# EAGLE design rotary_encoder_board (EAGLE 7.2.0)
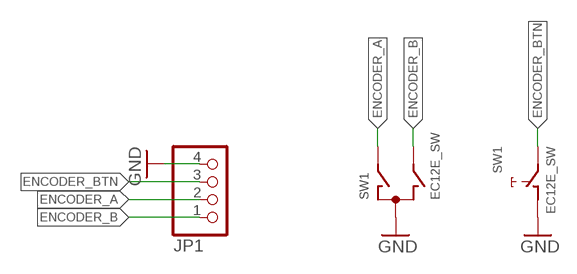
[diagram p0: schematic, sheet 1]

## Parts
JP1  PINHD-1X4/90  [1X04/90]
SW1  EC12E_SW  [ALPS_EC12E_SW]

## Nets
ENCODER_A: JP1.2 SW1.A
ENCODER_B: JP1.1 SW1.B
ENCODER_BTN: JP1.3 SW1.E
GND: JP1.4 SW1.C SW1.D
Unconnected: SW1.GND1(G) SW1.GND2(G)

## Library data of the parts
JP1 = pinhead:PINHD-1X4: PIN HEADER
SW1 = switch-alps:EC12E_SW: ALPS rotary Encoder EC12E series with switch; MPN: EC12E2424407; OC_FARNELL: 1520813; OC_NEWARK: 74M1068

## Board
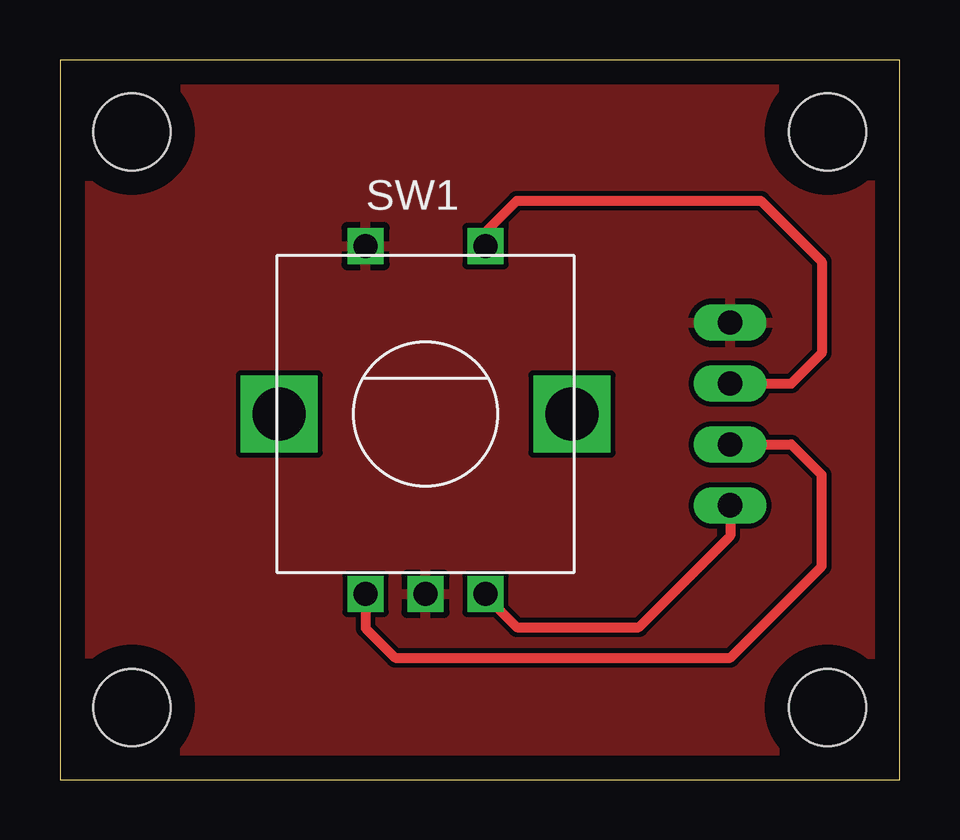
[diagram p1: board, top side]
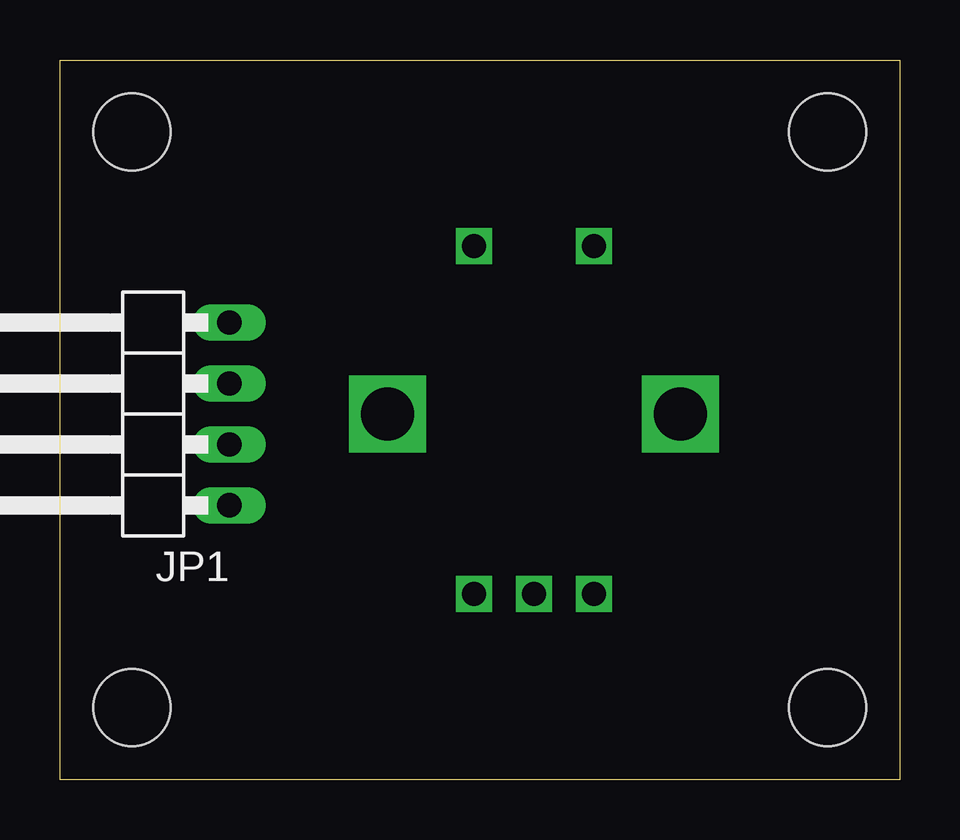
[diagram p2: board, bottom side, seen from below]

Size 35 x 30 mm. Coordinates in mm from the lower left corner, seen from the top.
Outline: 0,0 35,0 35,30 0,30 0,0
Copper layers (1*16): Top 0.035mm / dielectric 1.5mm / Bottom 0.035mm
Design rules "default": minimum track width 10mil, minimum drill 24mil, track to track 8mil, track to pad 8mil, pad to pad 8mil, via to via 8mil, smd to smd 8mil, copper to edge 40mil, drill to drill 8mil, minimum pad ring 10mil, minimum via ring 8mil, stop-mask expansion 4mil, vias tented up to drill 0mil, thermal gap 10mil
Holes 3.2 mm at 3,3 32,3 32,27 3,27

### Footprints (pad centres in the part's own frame; a part is rotated, then mirrored left to right if it is on the bottom)
1X04/90 = drill 1.016 long: 1 -3.81,-3.81; 2 -1.27,-3.81; 3 1.27,-3.81; 4 3.81,-3.81
ALPS_EC12E_SW = drill 1 square: A -2.5,-7.5; B 2.5,-7.5; C 0,-7.5; D -2.5,7; E 2.5,7 | drill 2.2 square: GND1 -6.1,0; GND2 6.1,0

### Placement (x,y rotation side)
JP1  31.75,15.24 90 bottom
SW1  15.24,15.24 0 top

### Tracks (layer width: path | path; a pad name or v marks a point on that pad's centre or on a via)
ENCODER_A
  Top 0.406: SW1.A 12.74,6.31 13.97,5.08 27.94,5.08 31.75,8.89 31.75,12.7 30.48,13.97 JP1.2
ENCODER_B
  Top 0.406: SW1.B 17.74,7.66 19.05,6.35 24.13,6.35 27.94,10.16 JP1.1
ENCODER_BTN
  Top 0.406: SW1.E 17.74,22.82 19.05,24.13 29.21,24.13 31.75,21.59 31.75,17.78 30.48,16.51 JP1.3
GND
  pour Top: -1.27,31.75 36.83,31.75 36.83,-1.27 -1.27,-1.27